# Altium schematic sheet LED_Shield_PCB_v11.SchDoc
size A4; SheetNumber: 1; SheetTotal: 1
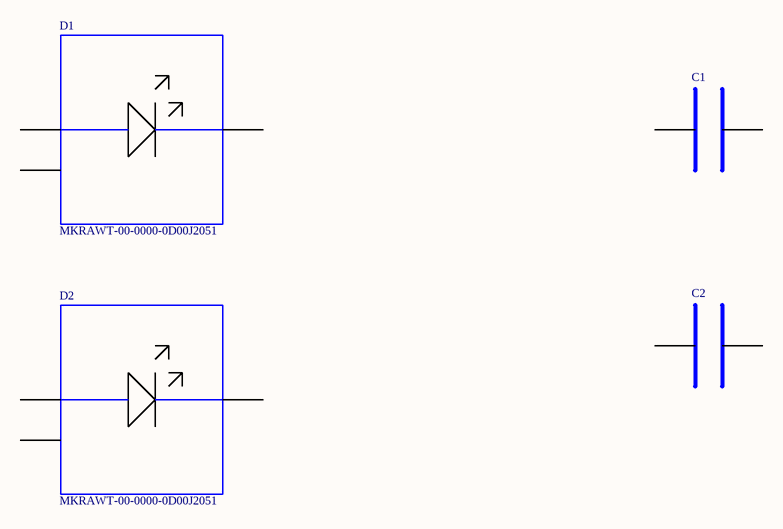
[diagram p0: LED_Shield_PCB_v11.SchDoc]

## Parts
C1  MSAST219LB5106KTNA01  [C_0805 (2012 Metric)]  (value not drawn)
C2  MSAST219LB5106KTNA01  [C_0805 (2012 Metric)]  (value not drawn)
D1  MKRAWT-00-0000-0D00J2051  [MKRAWT-00-0000-0D00J2051]
D2  MKRAWT-00-0000-0D00J2051  [MKRAWT-00-0000-0D00J2051]

## Nets

Not connected (* = marked no-connect by the designer): C1 0 1; C2 0 1; D1 0 1 2; D2 0 1 2

## Library data of the parts
C1 C2 = MSAST219LB5106KTNA01: Ceramic Capacitor, Multilayer, Ceramic, 25V, 10% +Tol, 10% -Tol, X5R, 15% TC, 10uF, Surface Mount, 0805; Manufacturer: TAIYO YUDEN; Value: 10µF; Supplier: Arrow Electronics; Supplier Part Number: MSAST219LB5106KTNA01; Manufacturer Part Number: MSAST219LB5106KTNA01; RoHS: Compliant; Category: Ceramic Capacitors; Stock: 7; Pricing: 1=0,0066 (USD); Dielectric Material: Ceramic; Export Control Classification Number (ECCN) Code: EAR99; Height: 850µm; Harmonized Tariff Schedule (HTS) Code: 8532.24.00.20; Introduction Date: 2022-02-17; Length: 2mm; Lifecycle Status: Production; Max Operating Temperature: 85°C; Min Operating Temperature: -55°C; Mounting Technology: Surface Mount; Number of Terminals: 2; REACH SVHC: Yes; Voltage Rating (DC): 25V; Width: 1.25mm; ComponentLink1URL: https://datasheet.octopart.com:443/MSAST219LB5106KTNA01-Taiyo-Yuden-datasheet-182126366.pdf?src-supplier=IHS; ComponentLink1Description: https://datasheet.octopart.com:443/MSAST219LB5106KTNA01-Taiyo-Yuden-datasheet-182126366.pdf?src-supplier=IHS
D1 D2 = MKRAWT-00-0000-0D00J2051: LED Lighting XLamp® MK-R White, Cool 6200K 12V 700mA 120° 2828 (7070 Metric); Manufacturer: Wolfspeed; Forward Current: 1.25A; Forward Voltage: 14V; Lens Color: Clear; Luminous Flux: 1.04klm; Luminous Intensity: 120cd; Number of Elements: 1; Reverse Voltage: 5V; Supplier: Arrow Electronics; Supplier Part Number: MKRAWT-00-0000-0D00J2051; Manufacturer Part Number: MKRAWT-00-0000-0D00J2051; RoHS: Compliant; Category: LEDs; Pricing: 1000=4,355, 2000=4,312, 3000=4,269, 4000=4,226, 5000=4,184, 6000=4,142, 10000=4,101, 20000=4,06, 25000=4,019 (USD); Case/Package: SMD/SMT; China RoHS: Compliant; Color: White; Height: 4.08mm; Illumination Color: White; Length: 7mm; Max Current Rating: 1.25A; Mounting Technology: Surface Mount; Pins: 2; REACH SVHC: Yes; Test Current: 700mA; Viewing Angle: 120°; Width: 7mm; ComponentLink1URL: https://datasheet.octopart.com:443/MKRAWT-00-0000-0D00J2051-Wolfspeed-datasheet-181532352.pdf?src-supplier=IHS; ComponentLink1Description: https://datasheet.octopart.com:443/MKRAWT-00-0000-0D00J2051-Wolfspeed-datasheet-181532352.pdf?src-supplier=IHS